# EAGLE design Flight Controller (EAGLE 6.0)
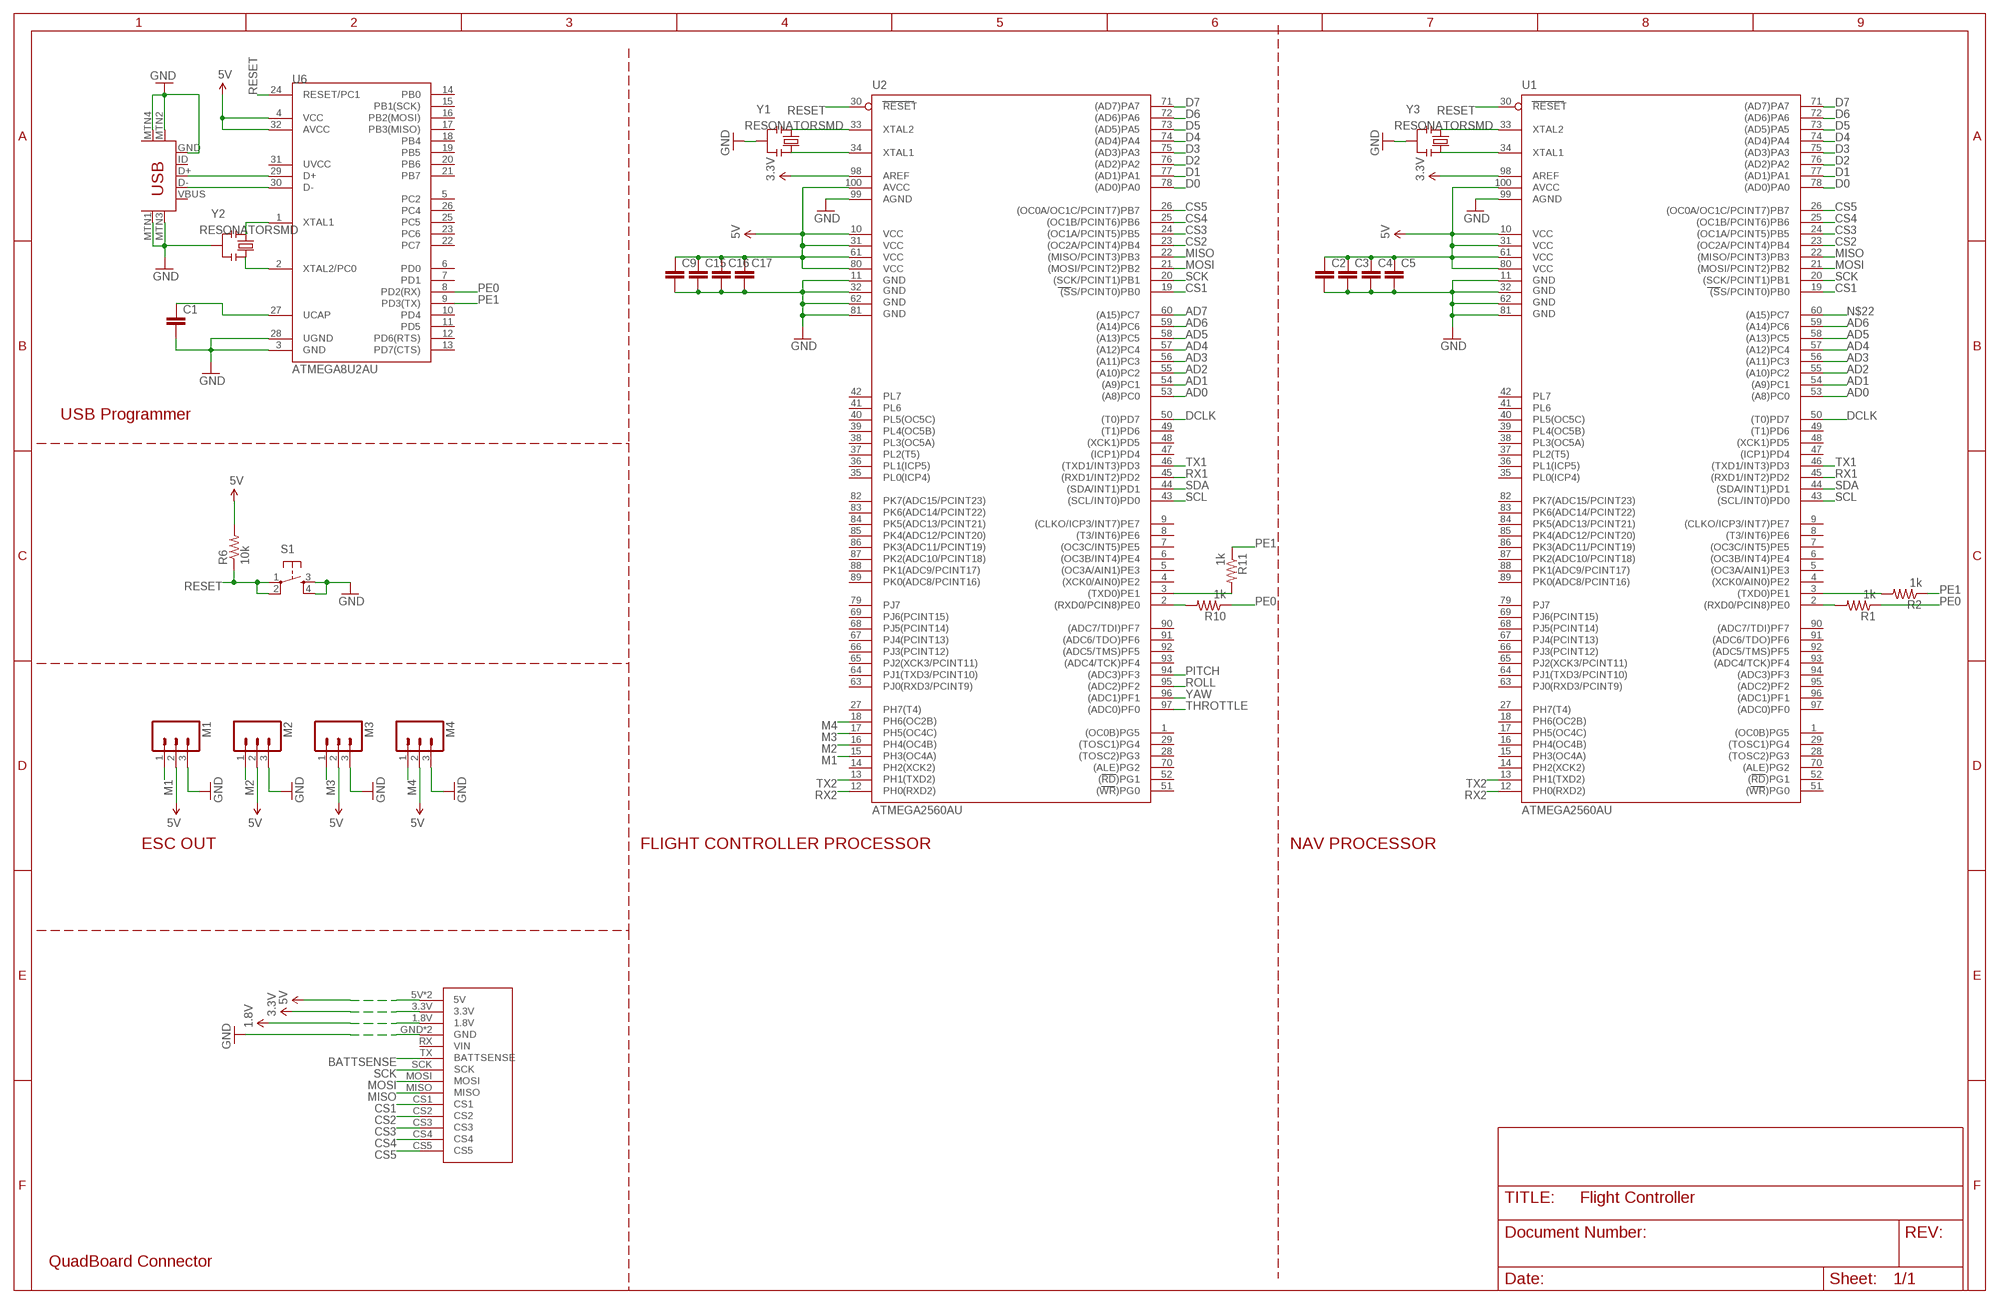
[diagram p0: schematic, sheet 1]

## Parts
C1  CAP0805  [0805]
C2  CAP0805  [0805]
C3  CAP0805  [0805]
C4  CAP0805  [0805]
C5  CAP0805  [0805]
C9  CAP0805  [0805]
C15  CAP0805  [0805]
C16  CAP0805  [0805]
C17  CAP0805  [0805]
M1  M03PTH  [1X03]
M2  M03PTH  [1X03]
M3  M03PTH  [1X03]
M4  M03PTH  [1X03]
R1  1k  RESISTOR0805-RES  [0805]
R2  1k  RESISTOR0805-RES  [0805]
R6  10k  RESISTOR0805-RES  [0805]
R10  1k  RESISTOR0805-RES  [0805]
R11  1k  RESISTOR0805-RES  [0805]
S1  TAC_SWITCHSMD  [TACTILE_SWITCH_SMD]
U1  ATMEGA2560AU  [TQFP100]
U2  ATMEGA2560AU  [TQFP100]
U6  ATMEGA8U2AU  [TQFP32-08]
U$1  QUADBOARDEXT  [QUADBOARDEXT]
U$2  USB-MINIB-5PIN  [USB-MINIB]
Y1  RESONATORSMD  [RESONATOR-SMD]
Y2  RESONATORSMD  [RESONATOR-SMD]
Y3  RESONATORSMD  [RESONATOR-SMD]

## Nets
1.8V: U$1.1.8V
3.3V: U1.98(AREF) U2.98(AREF) U$1.3.3V
5V [POWER]: C2.1 C3.1 C4.1 C5.1 C9.1 C15.1 C16.1 C17.1 M1.2 M2.2 M3.2 M4.2 R6.2 U1.10(VCC) U1.31(VCC1) U1.61(VCC2) U1.80(VCC3) U1.100(AVCC) U2.10(VCC) U2.31(VCC1) U2.61(VCC2) U2.80(VCC3) U2.100(AVCC) U6.4(VCC) U6.32(AVCC) U$1.5V U$1.5V1(5V)
AD0: U1.53((A8)PC0) U2.53((A8)PC0)
AD1: U1.54((A9)PC1) U2.54((A9)PC1)
AD2: U1.55((A10)PC2) U2.55((A10)PC2)
AD3: U1.56((A11)PC3) U2.56((A11)PC3)
AD4: U1.57((A12)PC4) U2.57((A12)PC4)
AD5: U1.58((A13)PC5) U2.58((A13)PC5)
AD6: U1.59((A14)PC6) U2.59((A14)PC6)
AD7: U2.60((A15)PC7)
BATTSENSE: U$1.TX(BATTSENSE)
CS1: U1.19((SS/PCINT0)PB0) U2.19((SS/PCINT0)PB0) U$1.CS1
CS2: U1.23((OC2A/PCINT4)PB4) U2.23((OC2A/PCINT4)PB4) U$1.CS2
CS3: U1.24((OC1A/PCINT5)PB5) U2.24((OC1A/PCINT5)PB5) U$1.CS3
CS4: U1.25((OC1B/PCINT6)PB6) U2.25((OC1B/PCINT6)PB6) U$1.CS4
CS5: U1.26((OC0A/OC1C/PCINT7)PB7) U2.26((OC0A/OC1C/PCINT7)PB7) U$1.CS5
D0: U1.78((AD0)PA0) U2.78((AD0)PA0)
D1: U1.77((AD1)PA1) U2.77((AD1)PA1)
D2: U1.76((AD2)PA2) U2.76((AD2)PA2)
D3: U1.75((AD3)PA3) U2.75((AD3)PA3)
D4: U1.74((AD4)PA4) U2.74((AD4)PA4)
D5: U1.73((AD5)PA5) U2.73((AD5)PA5)
D6: U1.72((AD6)PA6) U2.72((AD6)PA6)
D7: U1.71((AD7)PA7) U2.71((AD7)PA7)
DCLK: U1.50((T0)PD7) U2.50((T0)PD7)
GND: C1.2 C2.2 C3.2 C4.2 C5.2 C9.2 C15.2 C16.2 C17.2 M1.3 M2.3 M3.3 M4.3 S1.3 S1.4 U1.11(GND) U1.32(GND1) U1.62(GND2) U1.81(GND3) U1.99(AGND) U2.11(GND) U2.32(GND1) U2.62(GND2) U2.81(GND3) U2.99(AGND) U6.3(GND) U6.28(UGND) U$1.GND U$1.GND1(GND) U$2.GND U$2.MTN1(MTN2) U$2.MTN2(MTN3) U$2.MTN3(MTN1) U$2.MTN4 Y1.2 Y2.2 Y3.2
M1: M1.1 U2.15(PH3(OC4A))
M2: M2.1 U2.16(PH4(OC4B))
M3: M3.1 U2.17(PH5(OC4C))
M4: M4.1 U2.18(PH6(OC2B))
MISO: U1.22((MISO/PCINT3)PB3) U2.22((MISO/PCINT3)PB3) U$1.MISO
MOSI: U1.21((MOSI/PCINT2)PB2) U2.21((MOSI/PCINT2)PB2) U$1.MOSI
N$1: U1.33(XTAL2) Y3.1
N$2: U1.34(XTAL1) Y3.3
N$3: R1.2 U1.2((RXD0/PCIN8)PE0)
N$4: R2.2 U1.3((TXD0)PE1)
N$8: U6.1(XTAL1) Y2.1
N$9: U2.33(XTAL2) Y1.1
N$10: U6.2(XTAL2/PC0) Y2.3
N$11: U6.30(D-) U$2.D-
N$12: U2.34(XTAL1) Y1.3
N$13: U6.29(D+) U$2.D+
N$14: R10.2 U2.2((RXD0/PCIN8)PE0)
N$15: R11.2 U2.3((TXD0)PE1)
N$16: C1.1 U6.27(UCAP)
N$22: U1.60((A15)PC7)
PE0: R1.1 R10.1 U6.8(PD2(RX))
PE1: R2.1 R11.1 U6.9(PD3(TX))
PITCH: U2.94((ADC3)PF3)
RESET: R6.1 S1.1 S1.2 U1.30(RESET) U2.30(RESET) U6.24(RESET/PC1)
ROLL: U2.95((ADC2)PF2)
RX1: U1.45((RXD1/INT2)PD2) U2.45((RXD1/INT2)PD2)
RX2: U1.12(PH0(RXD2)) U2.12(PH0(RXD2))
SCK: U1.20((SCK/PCINT1)PB1) U2.20((SCK/PCINT1)PB1) U$1.SCK
SCL: U1.43((SCL/INT0)PD0) U2.43((SCL/INT0)PD0)
SDA: U1.44((SDA/INT1)PD1) U2.44((SDA/INT1)PD1)
THROTTLE: U2.97((ADC0)PF0)
TX1: U1.46((TXD1/INT3)PD3) U2.46((TXD1/INT3)PD3)
TX2: U1.13(PH1(TXD2)) U2.13(PH1(TXD2))
YAW: U2.96((ADC1)PF1)
Unconnected: U1.1((OC0B)PG5) U1.4((XCK0/AIN0)PE2) U1.5((OC3A/AIN1)PE3) U1.6((OC3B/INT4)PE4) U1.7((OC3C/INT5)PE5) U1.8((T3/INT6)PE6) U1.9((CLKO/ICP3/INT7)PE7) U1.14(PH2(XCK2)) U1.15(PH3(OC4A)) U1.16(PH4(OC4B)) U1.17(PH5(OC4C)) U1.18(PH6(OC2B)) U1.27(PH7(T4)) U1.28((TOSC2)PG3) U1.29((TOSC1)PG4) U1.35(PL0(ICP4)) U1.36(PL1(ICP5)) U1.37(PL2(T5)) U1.38(PL3(OC5A)) U1.39(PL4(OC5B)) U1.40(PL5(OC5C)) U1.41(PL6) U1.42(PL7) U1.47((ICP1)PD4) U1.48((XCK1)PD5) U1.49((T1)PD6) U1.51((WR)PG0) U1.52((RD)PG1) U1.63(PJ0(RXD3/PCINT9)) U1.64(PJ1(TXD3/PCINT10)) U1.65(PJ2(XCK3/PCINT11)) U1.66(PJ3(PCINT12)) U1.67(PJ4(PCINT13)) U1.68(PJ5(PCINT14)) U1.69(PJ6(PCINT15)) U1.70((ALE)PG2) U1.79(PJ7) U1.82(PK7(ADC15/PCINT23)) U1.83(PK6(ADC14/PCINT22)) U1.84(PK5(ADC13/PCINT21)) U1.85(PK4(ADC12/PCINT20)) U1.86(PK3(ADC11/PCINT19)) U1.87(PK2(ADC10/PCINT18)) U1.88(PK1(ADC9/PCINT17)) U1.89(PK0(ADC8/PCINT16)) U1.90((ADC7/TDI)PF7) U1.91((ADC6/TDO)PF6) U1.92((ADC5/TMS)PF5) U1.93((ADC4/TCK)PF4) U1.94((ADC3)PF3) U1.95((ADC2)PF2) U1.96((ADC1)PF1) U1.97((ADC0)PF0) U2.1((OC0B)PG5) U2.4((XCK0/AIN0)PE2) U2.5((OC3A/AIN1)PE3) U2.6((OC3B/INT4)PE4) U2.7((OC3C/INT5)PE5) U2.8((T3/INT6)PE6) U2.9((CLKO/ICP3/INT7)PE7) U2.14(PH2(XCK2)) U2.27(PH7(T4)) U2.28((TOSC2)PG3) U2.29((TOSC1)PG4) U2.35(PL0(ICP4)) U2.36(PL1(ICP5)) U2.37(PL2(T5)) U2.38(PL3(OC5A)) U2.39(PL4(OC5B)) U2.40(PL5(OC5C)) U2.41(PL6) U2.42(PL7) U2.47((ICP1)PD4) U2.48((XCK1)PD5) U2.49((T1)PD6) U2.51((WR)PG0) U2.52((RD)PG1) U2.63(PJ0(RXD3/PCINT9)) U2.64(PJ1(TXD3/PCINT10)) U2.65(PJ2(XCK3/PCINT11)) U2.66(PJ3(PCINT12)) U2.67(PJ4(PCINT13)) U2.68(PJ5(PCINT14)) U2.69(PJ6(PCINT15)) U2.70((ALE)PG2) U2.79(PJ7) U2.82(PK7(ADC15/PCINT23)) U2.83(PK6(ADC14/PCINT22)) U2.84(PK5(ADC13/PCINT21)) U2.85(PK4(ADC12/PCINT20)) U2.86(PK3(ADC11/PCINT19)) U2.87(PK2(ADC10/PCINT18)) U2.88(PK1(ADC9/PCINT17)) U2.89(PK0(ADC8/PCINT16)) U2.90((ADC7/TDI)PF7) U2.91((ADC6/TDO)PF6) U2.92((ADC5/TMS)PF5) U2.93((ADC4/TCK)PF4) U6.5(PC2) U6.6(PD0) U6.7(PD1) U6.10(PD4) U6.11(PD5) U6.12(PD6(RTS)) U6.13(PD7(CTS)) U6.14(PB0) U6.15(PB1(SCK)) U6.16(PB2(MOSI)) U6.17(PB3(MISO)) U6.18(PB4) U6.19(PB5) U6.20(PB6) U6.21(PB7) U6.22(PC7) U6.23(PC6) U6.25(PC5) U6.26(PC4) U6.31(UVCC) U$1.RX(VIN) U$2.ID U$2.VBUS

## Notes on the sheet
- USB Programmer
- ESC OUT | FLIGHT CONTROLLER PROCESSOR | NAV PROCESSOR
- QuadBoard Connector

## Library data of the parts
C1-C5 C9 C15-C17 = SparkFun:CAP: Capacitor Standard 0603 ceramic capacitor, and 0.1" leaded capacitor.
M1-M4 = SparkFun:M03: Header 3 Standard 3-pin 0.1" header. Use with straight break away headers (SKU : PRT-00116), right angle break away headers (PRT-00553), swiss pins (PRT-00743), machine pins (PRT-00117), and female headers (PRT-00115). Molex polarized connector foot print use with SKU : PRT-08232 with associated crimp pins and housings.
R1 R2 R6 R10 R11 = SparkFun:RESISTOR: Resistor Basic schematic elements and footprints for 0603, 1206, and PTH resistors.
S1 = SparkFun:TAC_SWITCH: Momentary Switch Button commonly used for reset or general input. Spark Fun Electronics SKU : COM-00097
U1 U2 = SparkFun:ATMEGA2560: MICROCONTROLLER 64/128/256 Kbytes FLASH 4 Kbytes EEPROM 8 Kbytes SRAM 86 General Purpose I/O pins 12-channels16-bit PWM 4 x Serial USARTs 16-channels 10-bit A/D
U6 = SparkFun:ATMEGA8U2: Atmel 8-bit Microcontroller with 8/16/32K Bystes of ISP Flash and USB Controller. ATmega8U2, ATmega16U2, and ATmega32U2
U$1 = terrys:QUADBOARDEXT
U$2 = SparkFun:USB-MINIB: Mini-USB "B" connector with 5th pin broken out. Created new symbol breaking out 5th "ID" pin in mini/micro USB connector spec. See: http://en.wikipedia.org/wiki/Mini_usb#Cables. Uses same footprint as 4-pin symbol. Also added pins to connect to mounting / shield pads if required (probably not generally needed as signals aren't shielded once they leave the connector).
Y1-Y3 = SparkFun:RESONATOR: Resonator Small SMD resonator. This is the itty bitty 10/20MHz resonators with built in caps. CSTCE10M0G55 and CSTCE20M0V53. Footprint has been reviewed closely but hasn't been tested yet.

## Net classes
0 default: width 0.203 mm, drill 0.406 mm, clearance 0.203 mm
1 POWER: width 0.203 mm, drill 0.406 mm, clearance 0.203 mm

## Board
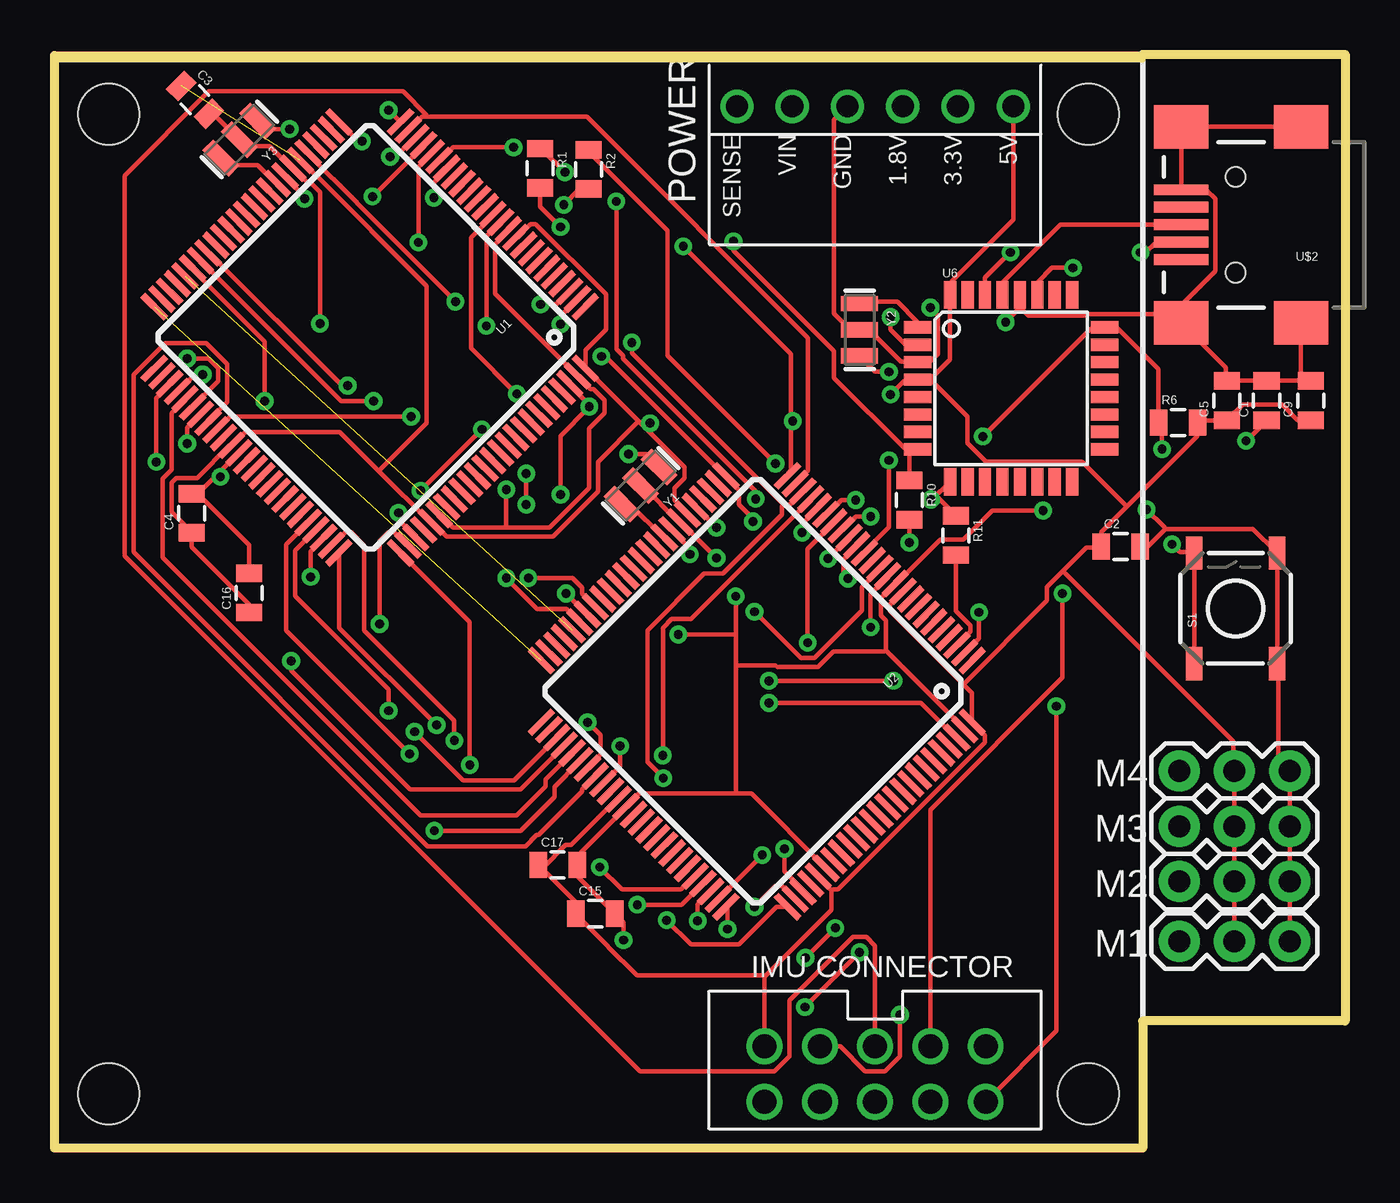
[diagram p1: board, top side]
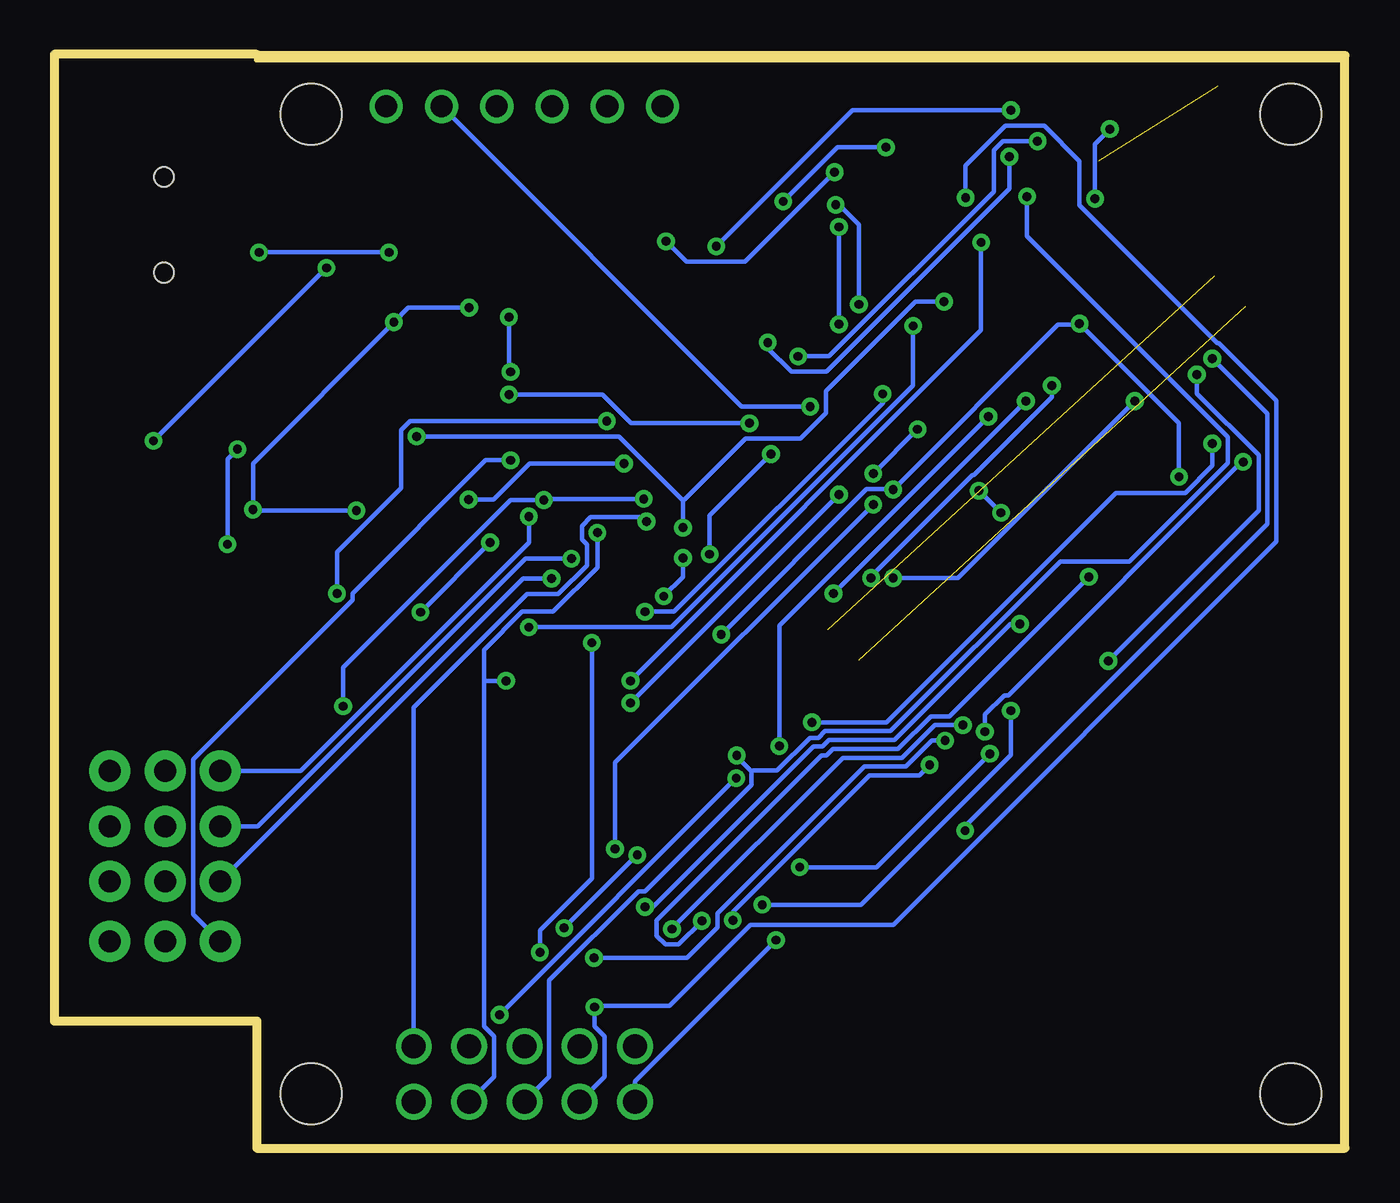
[diagram p2: board, bottom side, seen from below]

Size 59.29 x 50.25 mm. Coordinates in mm from the lower left corner, seen from the top.
Outline: 0.01,50.2 49.99,50.2 49.99,50.25 59.29,50.25 59.29,5.85 49.99,5.85 49.99,0.01 0.01,0.01 0.01,50.2
Copper layers (1*16): Top 0.035mm / dielectric 1.5mm / Bottom 0.035mm
Design rules: minimum track width 8mil, minimum drill 16mil, track to track 8mil, track to pad 8mil, pad to pad 8mil, via to via 8mil, smd to smd 8mil, copper to edge 40mil, drill to drill 8mil, minimum pad ring 10mil, minimum via ring 8mil, stop-mask expansion 4mil, vias tented up to drill 16mil, thermal gap 10mil

### Footprints (pad centres in the part's own frame; a part is rotated, then mirrored left to right if it is on the bottom)
0805 = smd 0.8 x 1.2: 1 -0.9,0; 2 0.9,0
1X03 = drill 1.016 pad 1.88: 1 0,0; 2 2.54,0; 3 5.08,0
TACTILE_SWITCH_SMD = smd 1.524 x 0.762: 1 -2.54,1.905; 2 2.54,1.905; 3 -2.54,-1.905; 4 2.54,-1.905
TQFP100 = smd 1.5 x 0.3: 1 -8,6; 2 -8,5.5; 3 -8,5; 4 -8,4.5; 5 -8,4; 6 -8,3.5; 7 -8,3; 8 -8,2.5; 9 -8,2; 10 -8,1.5; 11 -8,1; 12 -8,0.5; 13 -8,0; 14 -8,-0.5; 15 -8,-1; 16 -8,-1.5; 17 -8,-2; 18 -8,-2.5; 19 -8,-3; 20 -8,-3.5; 21 -8,-4; 22 -8,-4.5; 23 -8,-5; 24 -8,-5.5; 25 -8,-6; 51 8,-6; 52 8,-5.5; 53 8,-5; 54 8,-4.5; 55 8,-4; 56 8,-3.5; 57 8,-3; 58 8,-2.5; 59 8,-2; 60 8,-1.5; 61 8,-1; 62 8,-0.5; 63 8,0; 64 8,0.5; 65 8,1; 66 8,1.5; 67 8,2; 68 8,2.5; 69 8,3; 70 8,3.5; 71 8,4; 72 8,4.5; 73 8,5; 74 8,5.5; 75 8,6 | smd 0.3 x 1.5: 26 -6,-8; 27 -5.5,-8; 28 -5,-8; 29 -4.5,-8; 30 -4,-8; 31 -3.5,-8; 32 -3,-8; 33 -2.5,-8; 34 -2,-8; 35 -1.5,-8; 36 -1,-8; 37 -0.5,-8; 38 0,-8; 39 0.5,-8; 40 1,-8; 41 1.5,-8; 42 2,-8; 43 2.5,-8; 44 3,-8; 45 3.5,-8; 46 4,-8; 47 4.5,-8; 48 5,-8; 49 5.5,-8; 50 6,-8; 76 6,8; 77 5.5,8; 78 5,8; 79 4.5,8; 80 4,8; 81 3.5,8; 82 3,8; 83 2.5,8; 84 2,8; 85 1.5,8; 86 1,8; 87 0.5,8; 88 0,8; 89 -0.5,8; 90 -1,8; 91 -1.5,8; 92 -2,8; 93 -2.5,8; 94 -3,8; 95 -3.5,8; 96 -4,8; 97 -4.5,8; 98 -5,8; 99 -5.5,8; 100 -6,8
TQFP32-08 = smd 1.27 x 0.559: 1 -4.293,2.8; 2 -4.293,2; 3 -4.293,1.2; 4 -4.293,0.4; 5 -4.293,-0.4; 6 -4.293,-1.2; 7 -4.293,-2; 8 -4.293,-2.8; 17 4.293,-2.8; 18 4.293,-2; 19 4.293,-1.2; 20 4.293,-0.4; 21 4.293,0.4; 22 4.293,1.2; 23 4.293,2; 24 4.293,2.8 | smd 0.559 x 1.27: 9 -2.8,-4.293; 10 -2,-4.293; 11 -1.2,-4.293; 12 -0.4,-4.293; 13 0.4,-4.293; 14 1.2,-4.293; 15 2,-4.293; 16 2.8,-4.293; 25 2.8,4.293; 26 2,4.293; 27 1.2,4.293; 28 0.4,4.293; 29 -0.4,4.293; 30 -1.2,4.293; 31 -2,4.293; 32 -2.8,4.293
QUADBOARDEXT = drill 1.016: 1.8V 13.97,22.86; 3.3V 16.51,22.86; 5V 19.05,22.86; GND 11.43,22.86; RX 8.89,22.86; TX 6.35,22.86 | drill 1.1: 5V1 7.62,-20.32; CS1 10.16,-22.86; CS2 10.16,-20.32; CS3 12.7,-20.32; CS4 15.24,-20.32; CS5 17.78,-20.32; GND1 7.62,-22.86; MISO 12.7,-22.86; MOSI 15.24,-22.86; SCK 17.78,-22.86 | hole 2.8: -22.5,22.5; 22.5,22.5; 22.5,-22.5; -22.5,-22.5
USB-MINIB = smd 2.5 x 0.5: D+ 2.5,0; D- 2.5,0.8; GND 2.5,-1.6; ID 2.5,-0.8; VBUS 2.5,1.6 | smd 2.5 x 2: MTN1 -3,4.5; MTN2 2.5,4.5; MTN3 -3,-4.5; MTN4 2.5,-4.5 | hole 0.9: 0,2.2; 0,-2.2
RESONATOR-SMD = smd 0.7 x 1.7: 1 -1.2,0; 2 0,0; 3 1.2,0

### Placement (x,y rotation side)
C1  55.68,34.35 90 top
C2  48.98,27.64 0 top
C3  6.46,48.16 315 top
C4  6.31,29.17 90 top
C5  53.85,34.35 90 top
C9  57.72,34.35 90 top
C15  24.85,10.78 0 top
C16  8.95,25.51 90 top
C17  23.12,13.01 0 top
M1  51.67,9.51 0 top
M2  51.67,12.25 0 top
M3  51.67,14.79 0 top
M4  51.67,17.33 0 top
R1  22.31,45.02 270 top
R2  24.54,44.96 270 top
R6  51.62,33.33 0 top
R10  39.27,29.78 270 top
R11  41.41,28.15 270 top
S1  54.26,24.8 90 top
U1  14.48,37.24 225 top
U2  32.26,20.99 225 top
U6  43.95,34.91 0 top
U$1  25,25 0 top
U$2  54.26,42.42 180 top
Y1  26.93,30.44 225 top
Y2  36.99,37.6 270 top
Y3  8.49,46.34 225 top

### Tracks (layer width: path | path; a pad name or v marks a point on that pad's centre or on a via)
3.3V  (via drill 0.41)
  Top 0.203: U1.98 23.68,35.06 24.57,34.17 v24.57,34.07 24.52,33.99 23.25,32.72 v23.25,30.03 | v32.82,20.45 39.81,20.45 41.38,18.88 41.43,18.88 U2.98
  Bottom 0.203: v24.57,34.07 27.72,34.07 U$1.3.3V | v23.25,30.03 v32.82,20.45
5V  (via drill 0.41)  (1 unrouted)
  Top 0.203: 26.84,33.4 24.39,35.85 U1.100 24.39,35.95 24.39,36.66 25.33,37.6 25.33,39.22 22.1,42.45 21.88,42.45 21.27,41.84 21.21,41.84 U1.10 | 26.84,33.4 27.15,33.09 | 27.15,33.09 28.94,31.3 28.94,30.79 28.48,30.33 28.48,29.78 29.06,29.19 29.06,29.14 U2.31 | C16.1 8.95,24.98 6.31,27.62 C4.1 6.26,28.35 5.39,29.22 5.39,30.59 5.59,30.79 6.56,30.79 8.06,32.29 U1.61 8.21,32.34 8.77,32.9 13.11,32.9 14.9,31.11 | 14.9,31.11 17.25,28.76 U1.80 17.41,28.71 18.02,28.1 22.92,28.1 24.98,30.16 24.98,31.53 26.84,33.4 | 14.9,31.11 17.1,33.31 17.1,39.61 11.97,44.74 11.94,44.74 U1.31 | U2.61 25.84,16.03 23.73,13.93 23.48,13.93 22.46,12.91 C17.1 23.93,11.31 23.93,10.78 C15.1 24.01,10.7 25.43,9.28 25.43,9.25 26.75,7.93 32.54,7.93 32.62,7.88 | 35.69,11.84 35.11,12.43 35.11,12.48 U2.80 | 35.69,11.84 35.69,10.95 32.62,7.88 | U$1.5V1 32.62,7.88 | 40.22,35.31 U6.4 39.58,35.26 39.05,35.26 v38.41,34.63 | 40.22,35.31 41.13,36.23 41.13,39.2 U6.32 41.2,39.27 41.2,39.81 44.05,42.65 U$1.5V | M1.2 M2.2 M3.2 M4.2 54.16,17.41 54.16,18.68 46.32,26.51 | 41.75,21.3 38.39,24.67 38.39,24.98 38.97,25.56 U2.10 | 41.75,21.3 42.15,20.91 42.15,19.59 U2.100 42.22,19.49 42.76,18.96 42.76,18.65 36,11.89 35.77,11.89 35.69,11.84 | 49.27,29.48 52.51,32.72 52.51,33.33 R6.2 52.61,33.38 52.66,33.43 53.85,33.43 C5.1 53.93,33.51 54.59,34.17 56.39,34.17 57.11,33.46 C9.1 | 49.27,29.48 48.09,28.3 C2.1 47.99,27.59 47.4,27.59 46.32,26.51 | 41.75,21.3 45.6,25.15 45.6,25.79 46.32,26.51 | 49.27,29.48 47.2,31.55 42.78,31.55 41.94,32.39 41.94,33.61 40.29,35.26 40.22,35.31 | v27.36,33.31 27.15,33.09
  Bottom 0.203: v27.36,33.31 32.8,33.31 34.12,34.63 v38.41,34.63
AD0  (via drill 0.41)
  Top 0.203: v4.68,31.53 4.68,34.45 5.29,35.06 U1.53 | v16.54,19.13 18.78,16.9 21.11,16.9 23.07,18.85 U2.53
  Bottom 0.203: v4.68,31.53 4.76,31.53 15.48,20.81 15.65,20.81 16.54,19.92 v16.54,19.13
AD1  (via drill 0.41)
  Top 0.203: v6.81,35.54 6.43,35.54 5.67,34.78 U1.54 | v10.88,22.38 10.88,21.95 16.34,16.49 21.42,16.49 23.43,18.5 U2.54
  Bottom 0.203: v6.81,35.54 6.81,34.68 3.97,31.83 3.97,29.29 v10.88,22.38
AD2
  Top 0.203: U1.55 5.98,34.4 5.98,34.35 5.39,33.76 5.39,31.17 4.99,30.77 4.99,27.13 16.82,15.3 21.24,15.3 22.56,16.62 22.56,16.95 23.76,18.14 U2.55
AD3  (via drill 0.41)
  Top 0.203: v17.46,14.59 21.42,14.59 22.97,16.14 22.97,16.59 24.11,17.74 24.11,17.79 U2.56 | v6.1,36.28 7.09,36.28 7.53,35.85 7.53,35.24 U1.56
  Bottom 0.203: v17.46,14.59 17.46,14.79 3.56,28.68 3.56,33.74 v6.1,36.28
AD4  (via drill 0.41)
  Top 0.203: v24.49,19.56 25.08,18.98 25.08,18.09 24.49,17.51 U2.57 | v6.1,32.37 6.1,33.1 6.69,33.69 U1.57
  Bottom 0.203: v24.49,19.56 21.06,19.56 10.52,30.11 7.35,30.11 6.1,31.35 v6.1,32.37
AD5
  Top 0.203: U1.58 7.07,33.41 7.93,34.27 7.93,36.02 6.97,36.99 5.09,36.99 3.64,35.54 3.64,27.39 17.15,13.88 21.65,13.88 22.16,14.38 22.23,14.38 24.24,16.39 24.24,16.49 24.82,17.08 U2.58
AD6  (via drill 0.41)
  Top 0.203: v16.39,33.61 8.08,33.61 7.47,33 7.42,33 U1.59 | v25.99,18.47 25.99,17.53 25.2,16.75 U2.59
  Bottom 0.203: v16.39,33.61 25.99,24.01 v25.99,18.47
CS1  (via drill 0.41)
  Top 0.203: v34.6,23.22 34.6,27.52 35.8,28.71 U2.19 | v34.47,6.48 v36.99,9 | v17.43,43.67 17.43,44.38 18.02,44.96 U1.19
  Bottom 0.203: v34.6,23.22 34.6,12.4 36.99,10.01 v36.99,9 | U$1.CS1 34.02,3.28 34.02,5.14 34.47,5.59 v34.47,6.48 34.4,6.53 31.05,6.53 27.31,10.27 20.76,10.27 3.16,27.87 3.16,34.35 5.8,36.99 5.87,36.99 12.2,43.31 12.2,45.34 13.82,46.97 15.6,46.97 17.43,45.14 v17.43,43.67
CS2  (via drill 0.41)
  Top 0.203: v15.42,45.55 15.68,45.55 16.54,46.41 16.59,46.41 U1.23 | v26.52,37.01 26.52,36.53 33.48,29.57 | 33.48,29.57 33.79,29.57 34.37,30.16 U2.23 | U$1.CS2 36.1,4.68 37.24,3.54 38.16,3.54 38.84,4.22 v38.84,6.13 | v27.97,17 27.24,17.74 27.24,23.78 29.85,26.4 30.71,26.4 33.43,29.12 33.43,29.5 33.48,29.57
  Bottom 0.203: v15.42,45.55 15.42,44.08 23.83,35.67 25.43,35.67 26.52,36.76 v26.52,37.01 | v27.97,17 v38.84,6.13
CS3
  Top 0.203: 17.1,47.38 24.47,47.38 34.63,37.22 34.63,31.12 34.04,30.54 U2.24 | 17.1,47.38 16.9,47.38 16.31,46.79 16.26,46.79 U1.24 | U$1.CS3 37.7,9.3 37.29,9.71 36.68,9.71 33.76,6.79 33.76,4.22 33.08,3.54 26.91,3.54 3.23,27.21 3.23,44.69 7.09,48.55 16.01,48.55 17.1,47.45 17.1,47.38
CS4  (via drill 0.41)
  Top 0.203: 33.84,33.41 33.84,36.48 v28.89,41.43 | 33.84,33.41 33.84,31.15 33.69,30.99 U2.25 | v15.35,47.68 15.88,47.15 U1.25 | U$1.CS4 40.24,15.55 46.31,21.62 v46.31,25.48 | v33.91,33.41 33.84,33.41
  Bottom 0.203: v28.89,41.43 22.64,47.68 v15.35,47.68 | v46.31,25.48 46.31,27.39 43.36,30.33 43.36,33 42.96,33.41 v33.91,33.41
CS5  (via drill 0.41)
  Top 0.203: v25.13,36.38 25.3,36.38 30.79,30.89 U2.26 30.89,30.79 31.45,30.23 31.45,29.57 32.09,28.94 v32.09,28.79 | v14.13,46.26 13.95,46.26 13.09,47.12 U1.26
  Bottom 0.203: v25.13,36.38 23.71,36.38 16.14,43.95 16.14,45.85 15.73,46.26 v14.13,46.26 | U$1.CS5 42.78,20.25 37.57,25.46 36.15,25.46 34.83,26.78 34.83,27.74 35.06,27.97 35.06,28.58 34.65,28.99 32.29,28.99 v32.09,28.79
D0  (via drill 0.41)
  Top 0.203: v33.53,13.75 33.53,12.71 34.37,11.87 34.37,11.82 U2.78 | v21.67,30.99 v21.67,29.57 | v16.82,30.21 v19.64,33.03 | v15.8,29.19 15.8,28.86 16.59,28.07 U1.78
  Bottom 0.203: v33.53,13.75 33.53,17.71 v21.67,29.57 | v19.64,33.03 v21.67,30.99 | v15.8,29.19 v16.82,30.21
D1  (via drill 0.41)
  Top 0.203: v14.94,24.09 14.94,27.9 15.35,28.3 15.6,28.3 16.19,27.72 16.24,27.72 U1.77 | v32.16,11.08 33.13,12.05 33.43,12.05 34.02,11.46 U2.77
  Bottom 0.203: v14.94,24.09 15.37,24.09 20.71,18.75 23.71,18.75 24.01,18.45 24.42,18.45 31.78,11.08 v32.16,11.08
D2  (via drill 0.41)
  Top 0.203: v28.12,10.47 29.24,9.35 31.45,9.35 33.18,11.08 33.66,11.08 U2.76 | v19.08,17.61 19.08,24.16 U1.76
  Bottom 0.203: v28.12,10.47 28.12,10.85 21.85,17.13 19.56,17.13 v19.08,17.61
D3  (via drill 0.41)
  Top 0.203: v17.56,19.44 13.09,23.91 13.09,27.34 U1.75 | v30.92,10.07 30.92,11.03 30.87,11.08 U2.75
  Bottom 0.203: v17.56,19.44 18.85,19.44 20.35,17.94 23.07,17.94 30.92,10.09 v30.92,10.07
D4  (via drill 0.41)
  Top 0.203: v18.37,18.73 18.37,19.64 14.23,23.78 14.23,27.69 13.62,28.3 13.37,28.3 12.78,27.72 12.73,27.72 U1.74 | v35.87,10.12 v34.5,8.74 | v32.52,13.47 30.51,11.46 U2.74
  Bottom 0.203: v18.37,18.73 18.98,18.73 20.17,17.53 22.08,17.53 28.84,10.78 28.84,10.14 30.23,8.74 v34.5,8.74 | v32.52,13.47 v35.87,10.12
D5  (via drill 0.41)
  Top 0.203: v11.77,26.25 11.77,27.41 12.35,28 U1.73 | v29.55,10.45 29.55,11.21 U2.73
  Bottom 0.203: v11.77,26.25 18.17,19.84 19.03,19.84 20.53,18.35 23.53,18.35 23.83,18.04 24.06,18.04 31.63,10.47 31.63,9.76 31.22,9.35 30.61,9.35 29.55,10.42 v29.55,10.45
D6  (via drill 0.41)
  Top 0.203: v26.78,11.18 28.81,11.18 29.78,12.15 U2.72 | v15.35,20.1 15.35,21.06 11.06,25.36 11.06,27.46 12,28.4 U1.72
  Bottom 0.203: v26.78,11.18 22.23,11.18 15.35,18.07 v15.35,20.1
D7  (via drill 0.41)
  Top 0.203: v25.05,12.91 26.07,11.89 28.79,11.89 29.37,12.48 29.42,12.48 U2.71 | v16.31,18.12 10.65,23.78 10.65,27.74 11.64,28.73 U1.71
  Bottom 0.203: v25.05,12.91 21.52,12.91 v16.31,18.12
DCLK  (1 unrouted)
GND  (via drill 0.41)
  Top 0.203: C2.2 50.22,27.64 51.04,28.45 | 51.04,28.45 55.05,28.45 S1.4 S1.3 56.22,22.18 56.22,17.89 56.7,17.41 M4.3 M3.3 M2.3 M1.3 | U$1.GND 35.82,47.25 35.82,38.34 36.51,37.65 36.91,37.65 Y2.2 37.42,37.6 38.89,36.12 39.66,36.12 U6.3 39.73,36.18 40.29,36.18 40.6,36.48 40.6,38.26 v40.24,38.61 | U$2.MTN3 51.87,46.92 U$2.MTN4 51.77,46.92 51.77,44.02 U$2.GND 51.87,44 52.94,44 53.32,43.62 53.32,40.29 51.42,38.39 U$2.MTN2 | U$2.MTN1 57.26,37.9 57.26,35.34 C9.2 57.72,35.26 55.76,35.26 C1.2 55.68,35.26 53.85,35.26 C5.2 53.8,35.34 53.8,35.87 51.82,37.85 U$2.MTN2 | 44.36,38.64 U6.28 | 44.36,38.64 44.74,38.26 47.43,38.26 47.48,38.31 51.37,38.31 51.75,37.93 U$2.MTN2 | v43.69,37.95 44.3,38.56 44.36,38.64 | v50.17,29.34 50.98,28.53 51.04,28.45 | 20.76,28.51 22.74,28.51 24.57,30.33 24.57,33.05 25.28,33.76 25.28,34.37 24.77,34.88 24.62,34.88 24.04,35.47 U1.99 23.96,35.54 20.25,39.25 20.25,41.54 20.83,42.12 20.83,42.17 U1.11 | 20.76,28.51 18.32,28.51 17.74,29.09 17.69,29.09 U1.81 | C3.2 7.12,47.5 7.32,47.5 Y3.2 8.57,46.29 8.82,46.03 9.89,46.03 10.88,45.04 10.93,45.04 U1.32 11.03,44.96 11.67,44.33 11.79,44.33 12.2,43.92 v12.2,37.88 | 7.5,30.97 U1.62 | 7.5,30.97 6.61,30.08 C4.2 6.66,30 8.95,27.72 C16.2 | 7.5,30.97 v7.63,30.84 | v20.76,30.26 20.76,28.51 | 38.21,22.87 41.79,19.29 41.79,19.23 U2.99 | 38.21,22.87 38.21,24.24 37.98,24.47 37.98,25.28 38.61,25.91 U2.11 38.72,25.99 40.7,27.97 41.76,27.97 43.09,29.29 v45.42,29.29 | Y1.2 27.01,30.44 28.66,28.79 28.71,28.79 U2.32 28.81,28.71 v30.41,27.11 | 31.3,16.29 26.85,16.29 26.32,15.75 U2.62 26.25,15.63 24.09,13.47 24.09,13.09 C17.2 24.04,13.01 24.04,12.48 25.74,10.78 C15.2 25.81,10.7 26.14,10.37 v26.14,9.56
  Top 0.203: 31.3,16.29 32.01,16.29 35.44,12.86 U2.81 | 31.3,16.29 31.3,22.18 | 31.3,22.18 31.3,23.6 | 31.3,23.6 v31.3,25.36 | 31.3,22.18 33.13,22.18 33.2,22.1 35.08,22.1 35.8,22.82 38.13,22.82 38.21,22.87 | 31.3,23.6 v28.66,23.6
  Bottom 0.203: v40.24,38.61 43.03,38.61 v43.69,37.95 43.75,37.88 50.17,31.45 v50.17,29.34 50.09,29.29 v45.42,29.29 | v7.63,30.84 7.63,33.31 v12.2,37.88 12.28,37.83 13.19,37.83 v20.76,30.26 20.83,30.28 21.98,30.28 v28.66,23.6 | v30.41,27.11 30.41,26.25 v31.3,25.36 | U$1.GND1 32.62,3.08 v26.14,9.56
M1  (via drill 0.41)
  Top 0.203: v38.34,31.6 38.34,28.53 37.22,27.41 37.22,27.36 U2.15
  Bottom 0.203: v38.34,31.6 39.48,31.6 45.6,25.48 45.6,25.18 52.91,17.86 52.91,10.75 M1.1
M2  (via drill 0.41)
  Top 0.203: v36.45,26.17 36.25,26.37 36.25,27.03 36.84,27.62 36.84,27.69 U2.16
  Bottom 0.203: v36.45,26.17 37.75,26.17 M2.1
M3  (via drill 0.41)
  Top 0.203: v35.54,27.08 36.51,28.05 U2.17
  Bottom 0.203: v35.54,27.08 37.65,27.08 49.94,14.79 M3.1
M4  (via drill 0.41)
  Top 0.203: v37.5,29.01 36.81,29.01 36.23,28.43 36.18,28.43 U2.18
  Bottom 0.203: v37.5,29.01 37.5,27.82 47.99,17.33 M4.1
MISO  (via drill 0.41)
  Top 0.203: v27.95,18.04 27.95,23.91 28.35,24.31 29.24,24.31 34.73,29.8 U2.22 | v14.61,43.72 16.95,46.06 U1.22
  Bottom 0.203: v27.95,18.04 27.95,17.99 27.26,17.3 | 27.26,17.3 27.26,16.69 32.16,11.79 32.47,11.79 36.56,7.7 36.56,3.28 U$1.MISO | v14.61,43.72 14.61,41.89 5.39,32.67 5.39,31.48 9.91,26.96 13.09,26.96 20.89,19.16 23.88,19.16 24.19,18.85 24.59,18.85 26.09,17.36 27.18,17.36 27.26,17.3
MOSI  (via drill 0.41)
  Top 0.203: v34.35,28.28 34.35,28.68 35.08,29.42 U2.21 | v16.72,41.61 16.72,45.09 17.3,45.68 U1.21 | v38.54,21.47 v32.82,21.47
  Bottom 0.203: v34.35,28.28 34.35,26.68 36.38,24.64 37.8,24.64 39.55,22.89 39.55,21.47 | 39.55,21.47 39.55,5.59 39.1,5.14 39.1,3.28 U$1.MOSI | v16.72,41.61 16.72,37.57 v32.82,21.47 | 39.55,21.47 v38.54,21.47
N$1  (via drill 0.41)
  Top 0.203: v11.49,43.62 11.49,43.72 10.6,44.61 U1.33 | v10.8,46.82 9.71,46.82 9.35,47.17 Y3.1
  Bottom 0.203: v11.49,43.62 11.49,46.13 v10.8,46.82
N$2
  Top 0.203: U1.34 10.22,44.33 10.17,44.33 9.33,45.17 7.96,45.17 7.65,45.47 Y3.3
N$3  (via drill 0.41)
  Top 0.203: R1.2 22.31,43.26 v23.25,42.32 | v23.25,37.85 23.25,38.23 24.01,39 U1.2
  Bottom 0.203: v23.25,37.85 v23.25,42.32
N$4  (via drill 0.41)
  Top 0.203: v23.4,43.34 24.11,44.05 R2.2 | v22.33,38.77 23.07,38.77 23.65,39.35 U1.3
  Bottom 0.203: v23.4,43.34 23.25,43.34 22.33,42.42 v22.33,38.77
N$8
  Top 0.203: U6.1 39.66,37.95 38.72,38.89 37.07,38.89 36.99,38.82 Y2.1
N$9  (via drill 0.41)
  Top 0.203: v29.19,27.29 29.19,27.54 28.38,28.35 U2.33 | v26.37,31.88 27.18,31.88 27.77,31.3 Y1.1
  Bottom 0.203: v29.19,27.29 29.19,29.06 v26.37,31.88
N$10  (via drill 0.41)
  Top 0.203: v38.41,38.18 38.41,37.6 39.1,36.91 U6.2 | v38.34,35.67 37.7,35.67 36.99,36.38 Y2.3
  Bottom 0.203: v38.41,38.18 38.41,35.74 v38.34,35.67
N$11  (via drill 0.41)
  Top 0.203: v43.92,41.15 42.76,39.99 U6.30 | v49.89,41.15 50.15,41.15 50.6,41.61 51.75,41.61 U$2.D-
  Bottom 0.203: v49.89,41.15 v43.92,41.15
N$12
  Top 0.203: U2.34 28,28.07 27.95,28.07 26.45,29.57 26.09,29.57 Y1.3
N$13
  Top 0.203: U$2.D+ 46.21,42.42 43.57,39.78 43.57,39.2 U6.29
N$14  (via drill 0.41)
  Top 0.203: v39.27,27.82 R10.2 | v42.48,24.62 42.48,23.43 41.82,22.77 U2.2
  Bottom 0.203: v42.48,24.62 v39.27,27.82
N$15
  Top 0.203: R11.2 41.41,24.67 42.07,24.01 42.07,23.73 U2.3
N$16  (via drill 0.41)
  Top 0.203: v54.74,32.49 55.68,33.43 C1.1 | v46.79,40.44 45.83,40.44 45.17,39.78 45.17,39.2 U6.27
  Bottom 0.203: v46.79,40.44 v54.74,32.49
PE0  (via drill 0.41)
  Top 0.203: v23.45,44.84 22.38,45.9 22.31,45.9 R1.1 | v31.2,41.66 31.2,41.23 35.82,36.61 35.82,35.39 39.1,32.11 U6.8 39.27,32.04 R10.1
  Bottom 0.203: v23.45,44.84 27.57,40.72 30.26,40.72 v31.2,41.66
PE1  (via drill 0.41)
  Top 0.203: R2.1 24.54,45.78 28.18,42.15 28.18,36.41 v33.13,31.45 | U6.9 41.13,30.61 40.32,29.8 v40.27,29.8 40.55,29.93 41.41,29.06 R11.1
  Bottom 0.203: v33.13,31.45 37.47,31.45 39.12,29.8 v40.27,29.8
RESET  (via drill 0.41)
  Top 0.203: S1.1 S1.2 52.28,27.39 51.7,27.39 v51.34,27.74 | v30.41,28.51 U2.30 | v42.65,32.7 47.61,37.65 48.16,37.65 U6.24 48.8,37.7 50.7,35.8 50.7,33.33 R6.1 50.78,33.26 50.88,33.15 v50.88,32.11 | v18.42,38.89 13.9,43.41 13.9,43.44 11.67,45.68 U1.30
  Bottom 0.203: 30.41,29.75 v30.41,28.51 | 30.41,29.75 33.36,32.7 v42.65,32.7 | v18.42,38.89 19.74,38.89 23.86,34.78 23.86,33.76 25.03,32.59 27.54,32.59 30.33,29.8 30.41,29.75 | v51.34,27.74 51.34,31.66 v50.88,32.11
RX1  (via drill 0.41)
  Top 0.203: v9.66,34.32 9.66,37.07 6.36,40.37 U1.45 | v20.76,26.19 22.18,24.77 23.53,24.77 24.11,24.19 U2.45
  Bottom 0.203: v9.66,34.32 17.79,26.19 v20.76,26.19
RX2  (via drill 0.41)
  Top 0.203: v37.5,23.93 37.5,25.46 38.26,26.22 38.26,26.27 U2.12 | v19.84,37.78 19.84,41.89 20.48,42.53 U1.12
  Bottom 0.203: v37.5,23.93 30.94,23.93 19.84,35.03 v19.84,37.78
SCK  (via drill 0.41)
  Top 0.203: v36.81,29.78 36.15,29.78 35.52,29.14 35.47,29.14 U2.20 | v46.03,20.3 46.03,5.39 U$1.SCK | v21.09,45.98 18.32,45.98 17.74,45.4 17.69,45.4 U1.20 | v25.81,43.49 25.81,36.71 26.12,36.41 26.12,36.28 32.21,30.18 v32.21,29.83
  Bottom 0.203: v46.03,20.3 46.03,22.08 38.34,29.78 v36.81,29.78 36.73,29.83 v32.21,29.83 | v21.09,45.98 23.32,45.98 v25.81,43.49
SCL  (via drill 0.41)
  Top 0.203: v13.47,35.03 13.21,35.03 7.12,41.13 U1.43 | v21.77,26.19 23.81,26.19 24.24,25.76 24.24,25.48 24.82,24.9 U2.43
  Bottom 0.203: v13.47,35.03 13.47,34.5 17.05,30.92 17.13,30.92 21.77,26.27 v21.77,26.19
SDA  (via drill 0.41)
  Top 0.203: v14.66,34.32 13.16,34.32 U1.44 | v23.5,25.48 24.47,24.52 U2.44
  Bottom 0.203: v23.5,25.48 v14.66,34.32
TX1  (1 unrouted)
TX2  (via drill 0.41)
  Top 0.203: v21.24,34.65 19.13,36.76 19.13,41.84 20.12,42.83 20.12,42.88 U1.13 | v32.16,24.64 34.3,22.51 34.91,22.51 37.09,24.7 37.09,25.79 37.93,26.63 U2.13
  Bottom 0.203: v21.24,34.65 21.24,34.22 30.82,24.64 v32.16,24.64